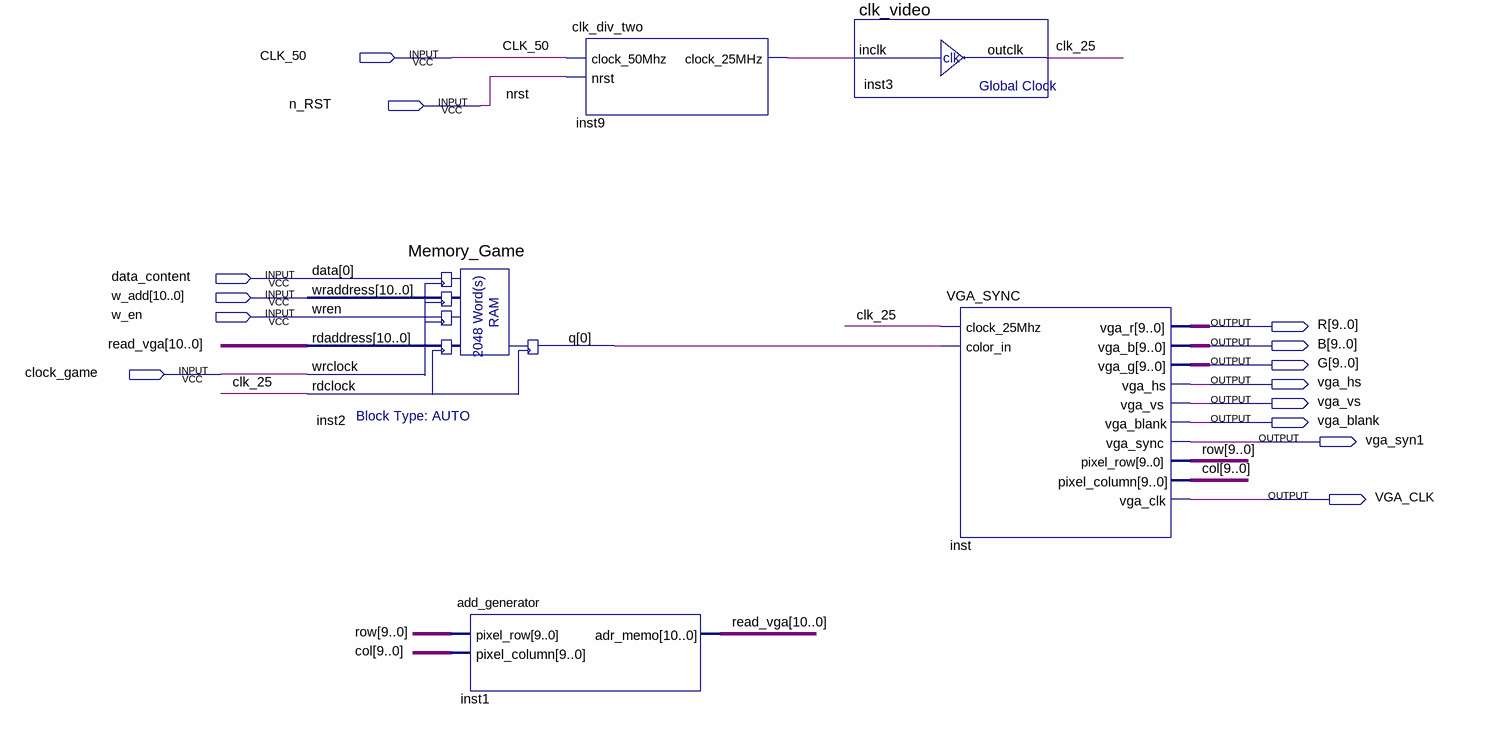
[diagram p0: schematic sheet]
// Quartus schematic VGA_Visualisation.bdf as structural Verilog: 5 symbols, 14 pins
module VGA_Visualisation (
  input  CLK_50,
  input  n_RST,
  input  data_content,
  input  [10:0] w_add,
  input  w_en,
  input  clock_game,
  output [9:0] R,
  output [9:0] B,
  output [9:0] G,
  output vga_hs,
  output vga_vs,
  output vga_blank,
  output vga_syn1,
  output VGA_CLK
);

  wire clk_25, inst2_q, inst9_clock_25mhz;
  wire [9:0] col, row;
  wire [10:0] read_vga;

  Memory_Game inst2 (
    .data(data_content), .wraddress(w_add), .wren(w_en), .rdaddress(read_vga), .wrclock(clock_game),
    .rdclock(clk_25), .q(inst2_q));
  add_generator inst1 (.pixel_row(row), .pixel_column(col), .adr_memo(read_vga));
  clk_div_two inst9 (.clock_50Mhz(CLK_50), .nrst(n_RST), .clock_25MHz(inst9_clock_25mhz));
  clk_video inst3 (.inclk(inst9_clock_25mhz), .outclk(clk_25));
  VGA_SYNC inst (
    .clock_25Mhz(clk_25), .color_in(inst2_q), .vga_r(R), .vga_b(B), .vga_g(G), .vga_hs(vga_hs),
    .vga_vs(vga_vs), .vga_blank(vga_blank), .vga_sync(vga_syn1), .pixel_row(row), .pixel_column(col),
    .vga_clk(VGA_CLK));

  // Other names for the same wires on the sheet: nrst = n_RST
endmodule
